# Altium schematic sheet USBToTTL.SchDoc: USB To TTL
size A4; SheetNumber: 3; SheetTotal: 7
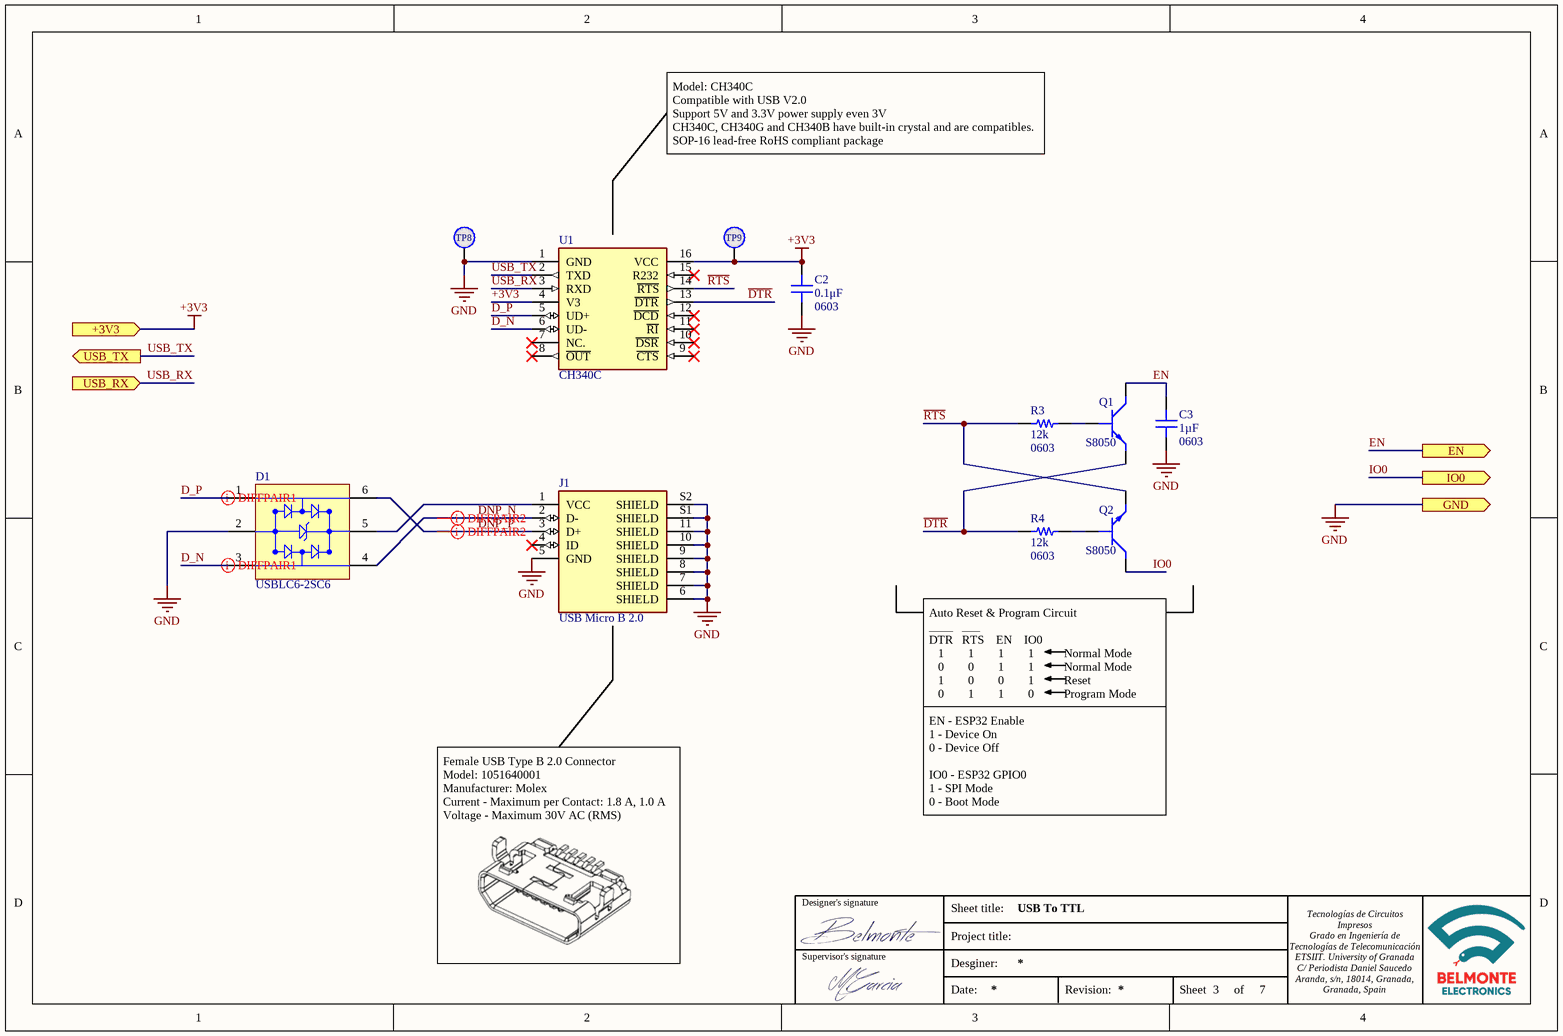
[diagram p0: USBToTTL.SchDoc]

## Parts
C2  0.1μF  Package: 0603  [FP-C0603C-CF-MFG]
C3  1µF  Size: 0603  [CAP 0603_1608]
D1  USBLC6-2SC6  [STM-SOT23-6L_V]
J1  USB Micro B 2.0  [AMPHENOL_10103594-0001LF]
Q1  S8050  [SOT95P240X115-3N]
Q2  S8050  [SOT95P240X115-3N]
R3  12k  Size: 0603  [RES 0603_1608]
R4  12k  Size: 0603  [RES 0603_1608]
TP8  Test point  [TestPoint]  (value not drawn)  (no BOM)
TP9  Test point  [TestPoint]  (value not drawn)  (no BOM)
U1  CH340C  [SOIC127P600X180-16N]

## Ports
+3V3 (in), EN (out), GND (out), IO0 (out), USB_RX (in), USB_TX (out)

## Nets
+3V3: C2.2 TP9.1 U1.4(V3) U1.16(VCC) ; port +3V3
GND: C2.1 C3.2 D1.2(GND) J1.5(GND) J1.6(SHIELD) J1.7(SHIELD) J1.8(SHIELD) J1.9(SHIELD) J1.10(SHIELD) J1.11(SHIELD) J1.S1(SHIELD) J1.S2(SHIELD) TP8.1 U1.1(GND) ; port GND
~{DTR}: Q1.3(E) R4.1 U1.13(~{DTR})
D_N: D1.3(I/O_2) U1.6(UD-)
D_P: D1.1(I/O_1) U1.5(UD+)
DNP_N: D1.4(I/O_3) J1.2(D-)
DNP_P: D1.6(I/O_4) J1.3(D+)
EN: C3.1 Q1.2(C) ; port EN
IO0: Q2.2(C) ; port IO0
~{RTS}: Q2.3(E) R3.1 U1.14(~{RTS})
USB_RX: U1.3(RXD) ; port USB_RX
USB_TX: U1.2(TXD) ; port USB_TX
NetD1_5: D1.5(VBUS) J1.1(VCC)
NetQ1_1: Q1.1(B) R3.2
NetQ2_1: Q2.1(B) R4.2

Not connected (* = marked no-connect by the designer): J1 4(ID)*; U1 7(NC.)* 8(~{OUT})* 9(~{CTS})* 10(~{DSR})* 11(~{RI})* 12(~{DCD})* 15(R232)*

## Layout directives
differential pair: D_N, D_P, DNP_N, DNP_P

## Notes on the sheet
- Model: CH340C
  Compatible with USB V2.0
  Support 5V and 3.3V power supply even 3V
  CH340C, CH340G and CH340B have built-in crystal and are compatibles.
  SOP-16 lead-free RoHS compliant package
- (near Q2) Auto Reset & Program Circuit
  ____   ___
  DTR   RTS    EN    IO0
  1        1        1        1	         Normal Mode
  0        0        1        1          Normal Mode
  1        0        0        1          Reset
  0        1        1        0          Program Mode
- EN - ESP32 Enable
  1 - Device On
  0 - Device Off
  IO0 - ESP32 GPIO0
  1 - SPI Mode
  0 - Boot Mode
- Female USB Type B 2.0 Connector
  Model: 1051640001
  Manufacturer: Molex
  Current - Maximum per Contact: 1.8 A, 1.0 A
  Voltage - Maximum 30V AC (RMS)
- Designer's signature
- Sheet title:
- Supervisor's signature
- Project title:
- Desginer:
- Date:
- Revision:
- Sheet
- of
- Tecnologías de Circuitos Impresos
  Grado en Ingeniería de Tecnologías de Telecomunicación
  ETSIIT. University of Granada
  C/ Periodista Daniel Saucedo Aranda, s/n, 18014, Granada, Granada, Spain

## Library data of the parts
C2 = CMP-2006-03061-2: CAP CER 0.1UF 50V X7R 0603; Manufacturer: KEMET; Manufacturer Part Number: C0603C104K5RACTU; Tolerance: 0.1; Temperature Coefficient: 30ppm/°C; Material: Ceramic; Automotive Grade: Grade 1; Capacitance: 0.10 μF; Temperature: -55°C to +125°C; RoHS: TRUE; Temperature Range High: +125°C; Lead Free: Yes; Octopart: https://octopart.com/c0603c104k5ractu-kemet-139244; Digikey Description: CAP CER 0.1UF 50V X7R 0603; Category: Cap; ComponentLink2Description: Datasheet; Temperature Range Low: -55°C; Device Class L1: Passive Components; Voltage Rating: 50 V; Automotive: Yes; Device Class L3: Ceramic Capacitors; ComponentLink2URL: https://api.kemet.com/component-edge/download/datasheet/C0603C100J5GACAUTO.pdf; Device Class L2: Capacitors; Temperature Characteristic: X7R; Height: 0.87mm
C3 = C0603C105K4RACAUTO: CAP CER 0603 1UF 16V X7R 10%; Manufacturer: KEMET; Part Number: C0603C105K4RACAUTO; Applications: Automotive, Bypass, Decoupling; Capacitance: 1µF; ComponentLink1Description: Datasheet; ComponentLink1URL: https://api.kemet.com/component-edge/download/datasheet/C0603C105K4RACAUTO.pdf; ComponentLink2Description: DigiKey Link; ComponentLink2URL: http://digikey.com/product-detail/en/kemet/C0603C105K4RACAUTO/399-17704-1-ND/8635855; Device Package: 0603 (1608 Metric); LastUpdated: 09/02/2020 01:03:36; Lifecycle Status: Active; Minimum Order: 1; Mounting Type: Surface Mount, MLCC; Operating Temperature: -55°C ~ 125°C; Package / Case: 0603 (1608 Metric); Packaging: TapeAndReel; PartId: 2179; Part Status: Active; Price: 0.02; Ratings: AEC-Q200; Series: SMD Auto X7R; Size / Dimension: 0.063" L x 0.031" W (1.60mm x 0.80mm); Supplier 1: DigiKey; Supplier Part Number 1: 399-17704-1-ND; Temperature Coefficient: X7R; Thickness (Max): 0.037" (0.95mm); Tolerance: ±10%; Voltage - Rated: 16V; Value: 1µF
D1 = CMP-2000-05378-1: Very low capacitance ESD protection, 3.5 pF, -40 to 125 degC, 6-Pin SOT23, RoHS, Tape and Reel; Manufacturer: STMicroelectronics; Polarity: Uni-Directional; Clamping Voltage: 17V; Rad Hardened: No; Product Height (mm): 1.3mm; Leakage Current (Max): 0.15uA; Product Length (mm): 3.05mm; Number of Elements: 1; Peak Pulse Current: 5A; Configuration: Dual; Reverse Breakdown Voltage: 6V; Working Voltage (Max): 5V; Capacitance Value: 3.5pF; Suppressor Type: DiodeArrays; Product Depth (mm): 1.75mm; Test Current (It): 1mA; Package / Case: SOT-23; Operating Temperature Max Deg. C: 125C; Package Description: 6-Pin Small Outline Transistor, Body 2.925 x 1.625 mm, Pitch 0.95 mm; Package Reference: SOT23-6L; Datasheet Version: Rev. 5, 10/2011; Operating Temperature Min Deg. C: -40C; Mounting Style: SurfaceMount; Direction Type: Uni-Directional; Mounting: SurfaceMount; Pin Count: 6; Leakage Current: 0.15uA; Packaging: TapeandReel; Operating Temperature Classification: Automotive; Clamping Voltage (Max): 17V; Manufacturer URL: http://www.st.com/; Reverse Stand-off Voltage: 5V; Datasheet URL: http://www.st.com/st-web-ui/static/active/en/resource/technical/document/datasheet/CD00050750.pdf; Working Voltage: 5V; Operating Temp Range: -40Cto125C; Manufacturer Part Number: USBLC6-2SC6
J1 = 10103594-0001LF: USB - micro B USB 2.0 Receptacle Connector 5 Position Surface Mount, Right Angle; Through Hole; MF: Amphenol ICC (FCI); Package: None; MP: 10103594-0001LF; Check_prices: https://www.snapeda.com/parts/10103594-0001LF/Amphenol%20FCI/view-part/5161044/?ref=eda; Purchase-URL: https://pricing.snapeda.com/search/part/10103594-0001LF/?ref=eda; Value: *; Availability: Good; Price: None; SnapEDA_Link: https://www.snapeda.com/parts/10103594-0001LF/Amphenol%20FCI/view-part/5161044/?ref=snap
Q1 Q2 = S8050: Transistor; Manufacturer_Name: Yenji Elec; Datasheet Link: https://datasheet.lcsc.com/szlcsc/Yenji-Elec-S8050_C139514.pdf; Height: 1.15mm; Manufacturer_Part_Number: S8050
R3 R4 = RMCF0603JT12K0: RES 12K OHM 5% 1/10W 0603; Manufacturer: Stackpole Electronics Inc; Power (Watts): 0.1W, 1/10W; Resistance: 12 kOhms; Temperature Coefficient: ±200ppm/°C; Value: 12 kOhms; Part Number: RMCF0603JT12K0; ComponentLink1Description: Datasheet; ComponentLink1URL: https://www.seielect.com/catalog/sei-rmcf_rmcp.pdf; ComponentLink2Description: DigiKey Link; ComponentLink2URL: http://digikey.com/product-detail/en/stackpole-electronics-inc/RMCF0603JT12K0/RMCF0603JT12K0CT-ND/1943192; Composition: Thick Film; Device Package: 0603 (1608 Metric); Features: Automotive AEC-Q200; Height - Seated (Max): 0.022" (0.55mm); LastUpdated: 09/02/2020 01:10:24; Lifecycle Status: Active; Minimum Order: 1; Number of Terminations: 2; Operating Temperature: -55°C ~ 155°C; Package / Case: 0603 (1608 Metric); Packaging: CutTape; PartId: 5166; Part Status: Active; Price: 0.10; Ratings: AEC-Q200; Series: RMCF; Size / Dimension: 0.061" L x 0.031" W (1.55mm x 0.80mm); Supplier 1: DigiKey; Supplier Part Number 1: RMCF0603JT12K0CT-ND; Supplier Device Package: 0603; Tolerance: ±5%
TP8 TP9 = TestPoint
U1 = CH340C: USB to serial chip CH340; MF: WCH; Package: None; Availability: Not in stock; SnapEDA_Link: https://www.snapeda.com/parts/CH340C/WCH/view-part/?ref=snap; MP: CH340C; Check_prices: https://www.snapeda.com/parts/CH340C/WCH/view-part/?ref=eda; Value: *; Price: None